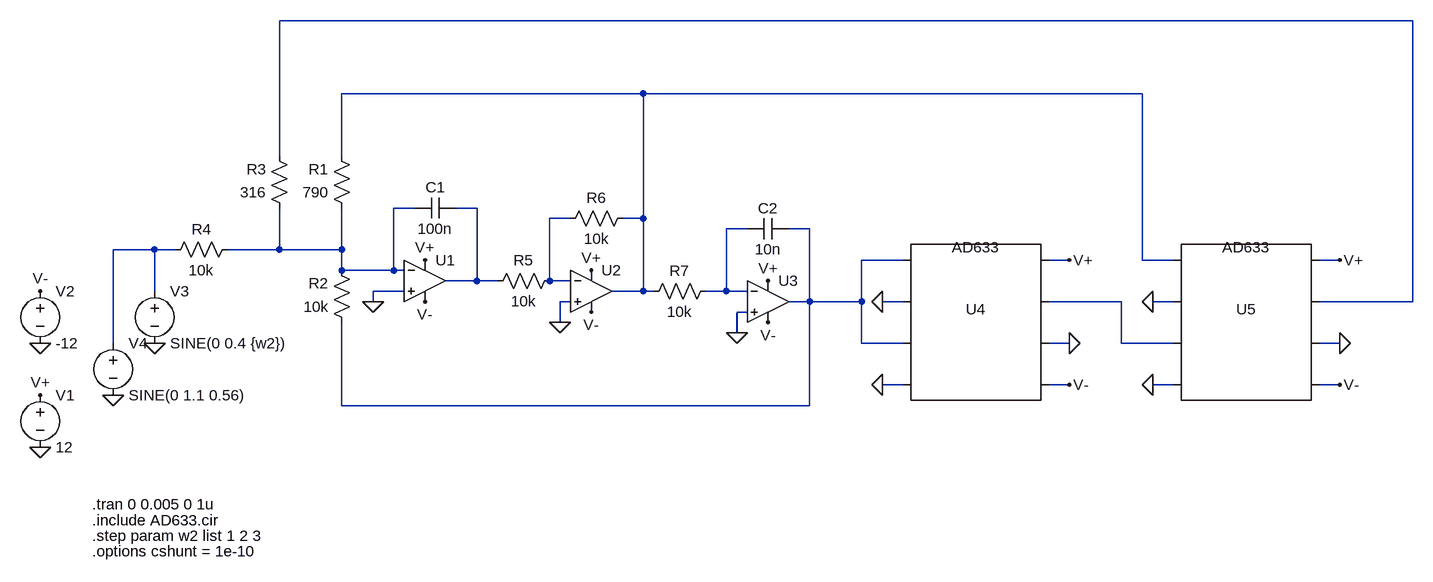
[diagram p0: schematic VdPMakouo.asc]
VdPMakouo.asc, the LTspice schematic file:
Version 4
SHEET 1 1908 736
WIRE 1744 -96 0 -96
WIRE 560 16 96 16
WIRE 1328 16 560 16
WIRE 0 112 0 -96
WIRE 96 112 96 16
WIRE 208 192 176 192
WIRE 304 192 272 192
WIRE 448 208 416 208
WIRE 560 208 560 16
WIRE 560 208 528 208
WIRE 720 224 688 224
WIRE 816 224 784 224
WIRE -192 256 -256 256
WIRE -160 256 -192 256
WIRE 0 256 0 192
WIRE 0 256 -80 256
WIRE 96 256 96 192
WIRE 96 256 0 256
WIRE 960 272 896 272
WIRE 1216 272 1184 272
WIRE 1328 272 1328 16
WIRE 1376 272 1328 272
WIRE 1632 272 1600 272
WIRE 96 288 96 256
WIRE 176 288 176 192
WIRE 176 288 96 288
WIRE 192 288 176 288
WIRE 304 304 304 192
WIRE 304 304 256 304
WIRE 336 304 304 304
WIRE 416 304 416 208
WIRE 448 304 416 304
WIRE -192 320 -192 256
WIRE 192 320 144 320
WIRE 560 320 560 208
WIRE 560 320 512 320
WIRE 576 320 560 320
WIRE 688 320 688 224
WIRE 688 320 656 320
WIRE 720 320 688 320
WIRE 144 336 144 320
WIRE 448 336 432 336
WIRE 816 336 816 224
WIRE 816 336 784 336
WIRE 896 336 896 272
WIRE 896 336 816 336
WIRE 960 336 928 336
WIRE 1296 336 1184 336
WIRE 1376 336 1344 336
WIRE 1744 336 1744 -96
WIRE 1744 336 1600 336
WIRE 720 352 704 352
WIRE 432 368 432 336
WIRE 704 384 704 352
WIRE -256 400 -256 256
WIRE 896 400 896 336
WIRE 960 400 896 400
WIRE 1216 400 1184 400
WIRE 1296 400 1296 336
WIRE 1376 400 1296 400
WIRE 1632 400 1600 400
WIRE 960 464 928 464
WIRE 1216 464 1184 464
WIRE 1376 464 1344 464
WIRE 1632 464 1600 464
WIRE 96 496 96 368
WIRE 816 496 816 336
WIRE 816 496 96 496
FLAG 144 336 0
FLAG -368 560 0
FLAG -368 400 0
FLAG -368 480 V+
FLAG 224 272 V+
FLAG -368 320 V-
FLAG 224 336 V-
FLAG 480 288 V+
FLAG 480 352 V-
FLAG 752 304 V+
FLAG 752 368 V-
FLAG -192 400 0
FLAG 432 368 0
FLAG 704 384 0
FLAG 928 336 0
FLAG 928 464 0
FLAG 1216 464 V-
FLAG 1216 272 V+
FLAG 1632 464 V-
FLAG 1632 272 V+
FLAG 1344 336 0
FLAG 1344 464 0
FLAG 1216 400 0
FLAG 1632 400 0
FLAG -256 480 0
SYMBOL res 112 208 R180
WINDOW 0 36 76 Left 2
WINDOW 3 36 40 Left 2
SYMATTR InstName R1
SYMATTR Value 790
SYMBOL res 112 384 R180
WINDOW 0 36 76 Left 2
WINDOW 3 36 40 Left 2
SYMATTR InstName R2
SYMATTR Value 10k
SYMBOL cap 272 176 R90
WINDOW 0 0 32 VBottom 2
WINDOW 3 32 32 VTop 2
SYMATTR InstName C1
SYMATTR Value 100n
SYMBOL res 432 288 R90
WINDOW 0 0 56 VBottom 2
WINDOW 3 32 56 VTop 2
SYMATTR InstName R5
SYMATTR Value 10k
SYMBOL res 544 192 R90
WINDOW 0 0 56 VBottom 2
WINDOW 3 32 56 VTop 2
SYMATTR InstName R6
SYMATTR Value 10k
SYMBOL res 672 304 R90
WINDOW 0 0 56 VBottom 2
WINDOW 3 32 56 VTop 2
SYMATTR InstName R7
SYMATTR Value 10k
SYMBOL cap 784 208 R90
WINDOW 0 0 32 VBottom 2
WINDOW 3 32 32 VTop 2
SYMATTR InstName C2
SYMATTR Value 10n
SYMBOL OpAmps\\UniversalOpamp2 224 304 R0
SYMATTR InstName U1
SYMATTR SpiceModel level.3a
SYMBOL voltage -368 464 R0
WINDOW 123 0 0 Left 0
WINDOW 39 0 0 Left 0
SYMATTR InstName V1
SYMATTR Value 12
SYMBOL voltage -368 304 R0
WINDOW 123 0 0 Left 0
WINDOW 39 0 0 Left 0
SYMATTR InstName V2
SYMATTR Value -12
SYMBOL OpAmps\\UniversalOpamp2 480 320 R0
SYMATTR InstName U2
SYMATTR SpiceModel level.3a
SYMBOL OpAmps\\UniversalOpamp2 752 336 R0
SYMATTR InstName U3
SYMBOL voltage -192 304 R0
WINDOW 123 0 0 Left 0
WINDOW 39 0 0 Left 0
SYMATTR InstName V3
SYMATTR Value SINE(0 0.4 {w2})
SYMBOL res 16 208 R180
WINDOW 0 36 76 Left 2
WINDOW 3 36 40 Left 2
SYMATTR InstName R3
SYMATTR Value 316
SYMBOL Misc\\DIP8 1072 368 R0
WINDOW 38 0 -116 Center 2
SYMATTR SpiceModel AD633
SYMATTR InstName U4
SYMBOL Misc\\DIP8 1488 368 R0
WINDOW 38 0 -116 Center 2
SYMATTR SpiceModel AD633
SYMATTR InstName U5
SYMBOL res -176 272 R270
WINDOW 0 32 56 VTop 2
WINDOW 3 0 56 VBottom 2
SYMATTR InstName R4
SYMATTR Value 10k
SYMBOL voltage -256 384 R0
WINDOW 123 0 0 Left 0
WINDOW 39 0 0 Left 0
SYMATTR InstName V4
SYMATTR Value SINE(0 1.1 0.56)
TEXT -288 648 Left 2 !.tran 0 0.005 0 1u
TEXT -288 672 Left 2 !.include AD633.cir
TEXT -288 696 Left 2 !.step param w2 list 1 2 3
TEXT -288 720 Left 2 !.options cshunt = 1e-10

The netlist it stands for:
* VdPMakouo.asc
R1 N003 N002 790
R2 N007 N003 10k
C1 N004 N003 100n
R5 N005 N004 10k
R6 N002 N005 10k
R7 N006 N002 10k
C2 N007 N006 10n
XU1 0 N003 V+ V- N004 level.3a Avol=1Meg GBW=10Meg Slew=10Meg ilimit=25m rail=0 Vos=0 phimargin=45 en=0 enk=0 in=0 ink=0 Rin=500Meg  ; pins IN+ IN- V+ V- OUT
V1 V+ 0 12
V2 V- 0 -12
XU2 0 N005 V+ V- N002 level.3a Avol=1Meg GBW=10Meg Slew=10Meg ilimit=25m rail=0 Vos=0 phimargin=45 en=0 enk=0 in=0 ink=0 Rin=500Meg  ; pins IN+ IN- V+ V- OUT
XU3 0 N006 V+ V- N007 level.2 Avol=1Meg GBW=10Meg Slew=10Meg ilimit=25m rail=0 Vos=0 phimargin=45 en=0 enk=0 in=0 ink=0 Rin=500Meg  ; pins IN+ IN- V+ V- OUT
V3 N008 0 SINE(0 0.4 {w2})
R3 N003 N001 316
XU4 N007 0 N007 0 V- 0 N009 V+ AD633
XU5 N002 0 N009 0 V- 0 N001 V+ AD633
R4 N008 N003 10k
V4 N008 0 SINE(0 1.1 0.56)
.tran 0 0.005 0 1u
.include AD633.cir
.step param w2 list 1 2 3
.options cshunt = 1e-10
.lib UniversalOpamps2.sub
.backanno
.end